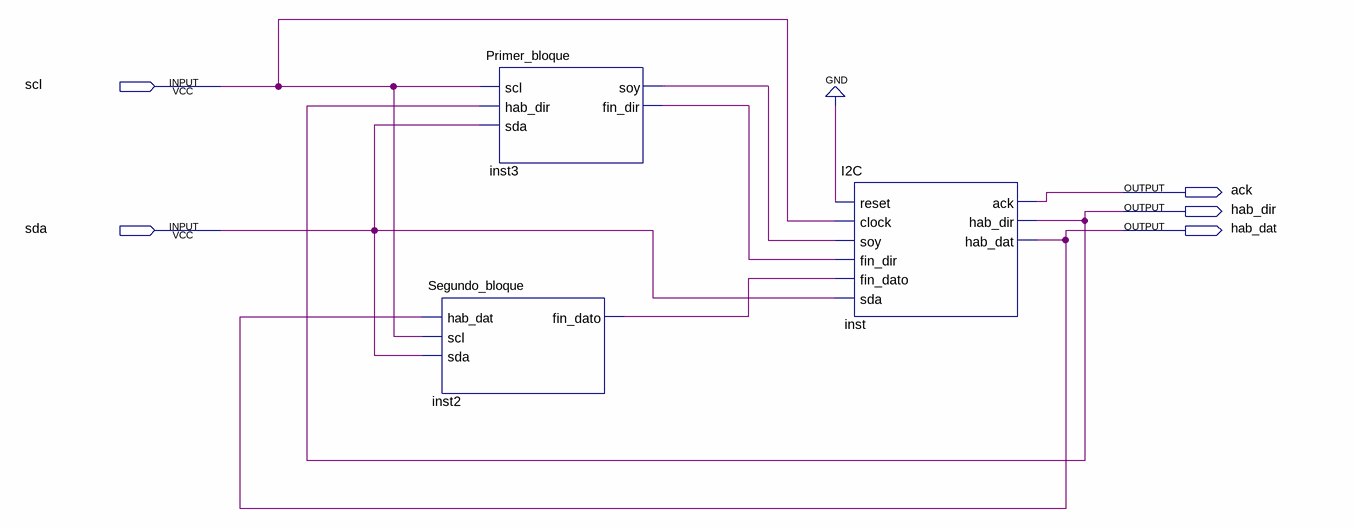
[diagram p0: schematic sheet]
// Quartus schematic Inter_Integrated_Circuit.bdf as structural Verilog: 3 symbols, 5 pins
module Inter_Integrated_Circuit (
  input  scl,
  input  sda,
  output ack,
  output hab_dir,
  output hab_dat
);

  wire inst2_fin_dato, inst3_fin_dir, inst3_soy;

  Segundo_bloque inst2 (.hab_dat(hab_dat), .scl(scl), .sda(sda), .fin_dato(inst2_fin_dato));
  Primer_bloque inst3 (.scl(scl), .hab_dir(hab_dir), .sda(sda), .soy(inst3_soy), .fin_dir(inst3_fin_dir));
  I2C inst (
    .reset(1'b0), .clock(scl), .soy(inst3_soy), .fin_dir(inst3_fin_dir), .fin_dato(inst2_fin_dato),
    .sda(sda), .ack(ack), .hab_dir(hab_dir), .hab_dat(hab_dat));
endmodule
